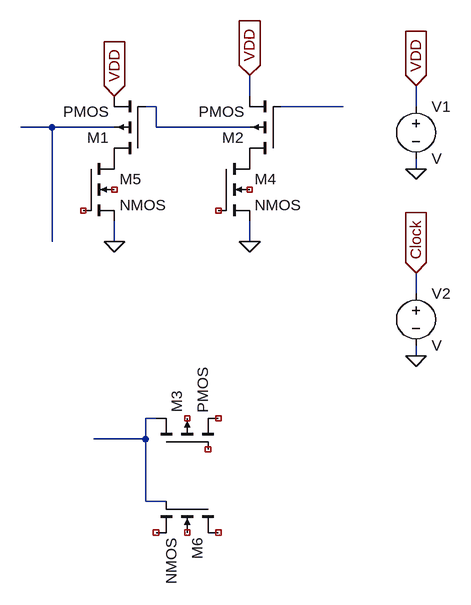
[diagram p0: schematic LATCHES_TRANSISTOR.asc]
LATCHES_TRANSISTOR.asc, the LTspice schematic file:
Version 4
SHEET 1 880 804
WIRE 288 48 288 16
WIRE 144 64 128 64
WIRE 432 64 336 64
WIRE 544 64 544 32
WIRE -16 96 -64 96
WIRE 80 96 -16 96
WIRE 144 96 144 64
WIRE 288 96 144 96
WIRE 544 160 544 144
WIRE -16 272 -16 96
WIRE 80 272 80 240
WIRE 288 272 288 240
WIRE 544 352 544 320
WIRE 544 448 544 432
WIRE 144 544 128 544
WIRE 128 576 128 544
WIRE 128 576 48 576
WIRE 128 672 128 576
WIRE 160 672 128 672
FLAG 288 272 0
FLAG 80 272 0
FLAG 544 160 0
FLAG 544 32 VDD
IOPIN 544 32 In
FLAG 288 16 VDD
IOPIN 288 16 In
FLAG 80 48 VDD
IOPIN 80 48 In
FLAG 544 448 0
FLAG 544 320 Clock
IOPIN 544 320 In
SYMBOL pmos4 128 144 R180
SYMATTR InstName M1
SYMBOL pmos4 336 144 R180
SYMATTR InstName M2
SYMBOL pmos4 144 592 R270
SYMATTR InstName M3
SYMBOL voltage 544 48 R0
SYMATTR InstName V1
SYMBOL nmos4 240 144 R0
SYMATTR InstName M4
SYMBOL nmos4 32 144 R0
SYMATTR InstName M5
SYMBOL nmos4 240 672 R90
SYMATTR InstName M6
SYMBOL voltage 544 336 R0
SYMATTR InstName V2

The netlist it stands for:
* LATCHES_TRANSISTOR.asc
M1 P001 N001 VDD N003 PMOS
M2 P002 N002 VDD N001 PMOS
M3 N004 NC_01 NC_02 NC_03 PMOS
V1 VDD 0 V
M4 P002 NC_04 0 NC_05 NMOS
M5 P001 NC_06 0 NC_07 NMOS
M6 NC_08 N004 NC_09 NC_10 NMOS
V2 Clock 0 V
.model NMOS NMOS
.model PMOS PMOS
.lib standard.mos
.backanno
.end